# EAGLE design Stereo Schematic Design 1 (EAGLE 9.6.2)
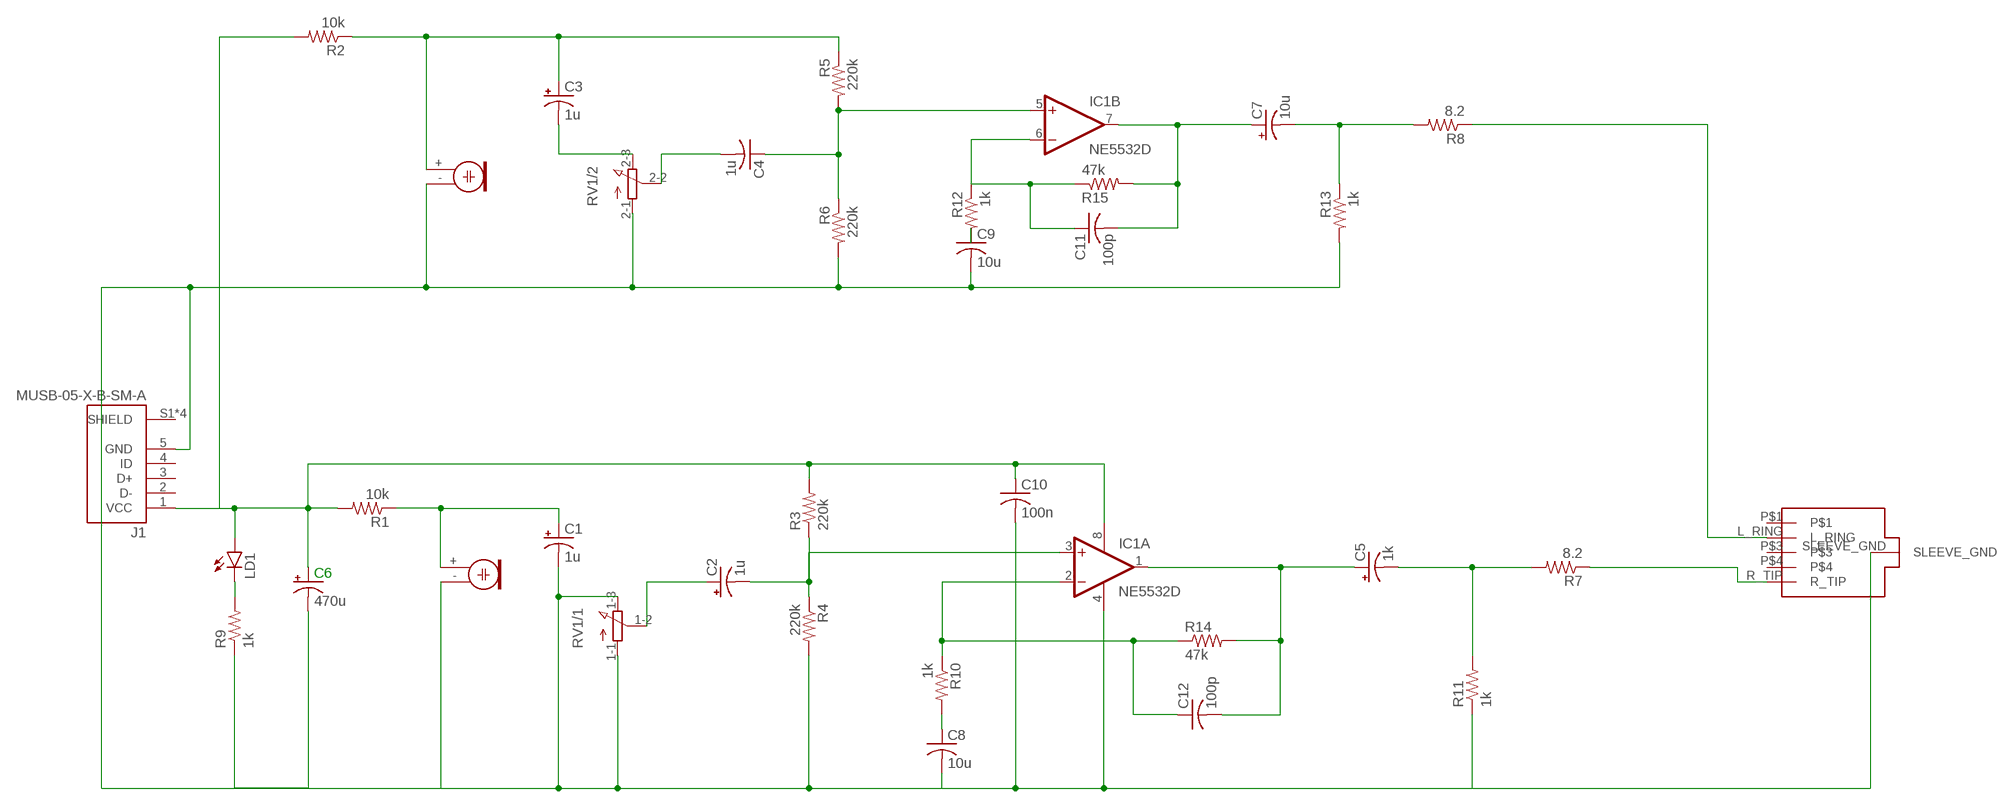
[diagram p0: schematic, sheet 1]

## Parts
C1  1u  CPOL-USE3.5-8  [E3,5-8]
C2  1u  CPOL-USE3.5-8  [E3,5-8]
C3  1u  CPOL-USE3.5-8  [E3,5-8]
C4  1u  C-USC0603  [C0603]
C5  1k  CPOL-USE3.5-8  [E3,5-8]
C6  470u  CPOL-USE3.5-8  [E3,5-8]
C7  10u  CPOL-USE3.5-8  [E3,5-8]
C8  10u  C-USC0805  [C0805]
C9  10u  C-USC0805  [C0805]
C10  100n  C-USC1206  [C1206]
C11  100p  C-USC0603  [C0603]
C12  100p  C-USC0603  [C0603]
IC1  NE5532D  [SO08]
J1  MUSB-05-X-B-SM-A  [SAMTEC_MUSB-05-X-B-SM-A]
LD1  LED3MM  [LED3MM]
M1  ELECTRET_MICROPHON-TOM-1545P-R  [TOM-1545P-R]
M2  ELECTRET_MICROPHON-TOM-1545P-R  [TOM-1545P-R]
R1  10k  R-US_R0805  [R0805]
R2  10k  R-US_R0805  [R0805]
R3  220k  R-US_R0603  [R0603]
R4  220k  R-US_R0603  [R0603]
R5  220k  R-US_R0603  [R0603]
R6  220k  R-US_R0603  [R0603]
R7  8.2  R-US_R0805  [R0805]
R8  8.2  R-US_R0805  [R0805]
R9  1k  R-US_R1206  [R1206]
R10  1k  R-US_R1206  [R1206]
R11  1k  R-US_R1206  [R1206]
R12  1k  R-US_R1206  [R1206]
R13  1k  R-US_0204/7  [0204/7]
R14  47k  R-US_0204/7  [0204/7]
R15  47k  R-US_0204/7  [0204/7]
RV1  3RP/1610G  [3RP/1610G]
U$1  KORTAKJACK  [REDPHONEJACK]

## Nets
N$1: C6.+ C10.1 IC1.8(P:V+) J1.1(VCC) LD1.A R1.2 R2.2 R3.2
N$2: LD1.K(C) R9.2
N$3: C1.- C8.2 C9.2 C10.2 IC1.4(P:V-) J1.5(GND) M2.- R4.2 R6.2 R11.1 R13.2 RV1.1-1(/1:A) RV1.1-3(/1:E) RV1.2-1(/2:A) U$1.SLEEVE_GND
N$4: C1.+ M1.+ R1.1
N$5: C8.1 R10.2
N$6: C2.+ RV1.1-2(/1:S)
N$7: C12.1 IC1.2(A:-IN) R10.1 R14.1
N$8: C5.+ C12.2 IC1.1(A:OUT) R14.2
N$9: C6.- R9.1
N$10: M1.-
N$11: C2.- IC1.3(A:+IN) R3.1 R4.1
N$12: C5.- R7.2 R11.2
N$13: R7.1 U$1.R_TIP
N$14: C3.+ M2.+ R2.1 R5.1
N$15: C3.- RV1.2-3(/2:E)
N$16: C4.2 RV1.2-2(/2:S)
N$17: C4.1 IC1.5(B:+IN) R5.2 R6.1
N$18: C11.1 IC1.6(B:-IN) R12.1 R15.1
N$19: C9.1 R12.2
N$20: C7.+ C11.2 IC1.7(B:OUT) R15.2
N$21: C7.- R8.2 R13.1
N$22: R8.1 U$1.L_RING
Unconnected: J1.2(D-) J1.3(D+) J1.4(ID) J1.S1(SHIELD) J1.S2(SHIELD) J1.S3(SHIELD) J1.S4(SHIELD) U$1.P$1 U$1.P$3 U$1.P$4

## Library data of the parts
C1-C3 C5-C7 = rcl:CPOL-US: POLARIZED CAPACITOR, American symbol; SPICEPREFIX: C
C4 C8-C12 = rcl:C-US: CAPACITOR, American symbol; SPICEPREFIX: C
IC1 = linear:NE5532: AUDIO AMPLIFIER
J1 = MUSB-05-X-B-SM-A:MUSB-05-X-B-SM-A: USB - mini B USB 2.0 Receptacle Connector 5 Position Surface Mount, Right Angle; MANUFACTURER: Samtec; MAXIMUM_PACKAGE_HEIGHT: 4.1 mm; PARTREV: AC; STANDARD: Manufacturer Recommendations
LD1 = led:LED: LED OSRAM: - CHIPLED LG R971, LG N971, LY N971, LG Q971, LY Q971, LO R971, LY R971 LH N974, LH R974 LS Q976, LO Q976, LY Q976 LO Q996 - Hyper CHIPLED LW Q18S LB Q993, LB Q99A, LB R99A - SideLED LS A670, LO A670, LY A670, LG A670, LP A670 LB A673, LV A673, LT A673, LW A673 LH A674 LY A675 LS A676, LA A676, LO A676, LY A676, LW A676 LS A679, LY A679, LG A679 - Hyper Micro SIDELED® LS Y876, LA Y876, LO Y876, LY Y876 LT Y87S - SmartLED LW L88C, LW L88S LB L89C, LB L89S, LG L890 LS L89K, LO L89K, LY L89K LS L896, LA L896, LO L896, LY L896 - TOPLED LS T670, LO T670, LY T670, LG T670, LP T670 LSG T670, LSP T670, LSY T670, LOP T670, LYG T670 LG T671, LOG T671, LSG T671 LB T673, LV T673, LT T673, LW T673 LH T674 LS T676, LA T676, LO T676, LY T676, LB T676, LH T676, LSB T676, LW T676 LB T67C, LV T67C, LT T67C, LS T67K, LO T67K, LY T67K, LW E67C LS E67B, LA E67B, LO E67B, LY E67B, LB E67C, LV E67C, LT E67C LW T67C LS T679, LY T679, LG T679 LS T770, LO T770, LY T770, LG T770, LP T770 LB T773, LV T773, LT T773, LW T773 LH T774 LS E675, LA E675, LY E675, LS T675 LS T776, LA T776, LO T776, LY T776, LB T776 LHGB T686 LT T68C, LB T68C - Hyper Mini TOPLED® LB M676 - Mini TOPLED Santana® LG M470 LS M47K, LO M47K, LY M47K Source: http://www.osram.convergy.de LUXEON: - LUMILED® LXK2-PW12-R00, LXK2-PW12-S00, LXK2-PW14-U00, LXK2-PW14-V00 LXK2-PM12-R00, LXK2-PM12-S00, LXK2-PM14-U00 LXK2-PE12-Q00, LXK2-PE12-R00, LXK2-PE12-S00, LXK2-PE14-T00, LXK2-PE14-U00 LXK2-PB12-K00, LXK2-PB12-L00, LXK2-PB12-M00, LXK2-PB14-N00, LXK2-PB14-P00, LXK2-PB14-Q00 LXK2-PR12-L00, LXK2-PR12-M00, LXK2-PR14-Q00, LXK2-PR14-R00 LXK2-PD12-Q00, LXK2-PD12-R00, LXK2-PD12-S00 LXK2-PH12-R00, LXK2-PH12-S00 LXK2-PL12-P00, LXK2-PL12-Q00, LXK2-PL12-R00 Source: www.luxeon.com KINGBRIGHT: KA-3528ASYC Source: www.kingbright.com
M1 M2 = microphon:ELECTRET_MICROPHON-: Electret Condenser Microphone
R1-R15 = rcl:R-US_: RESISTOR, American symbol; SPICEPREFIX: R
RV1 = pot:3RP/1610G: 16mm Potentiometer two level Source: http://www.alphapotentiometers.net/html/16mm_pot_2.html
U$1 = StereoAmp569:KORTAKJACK

## Board
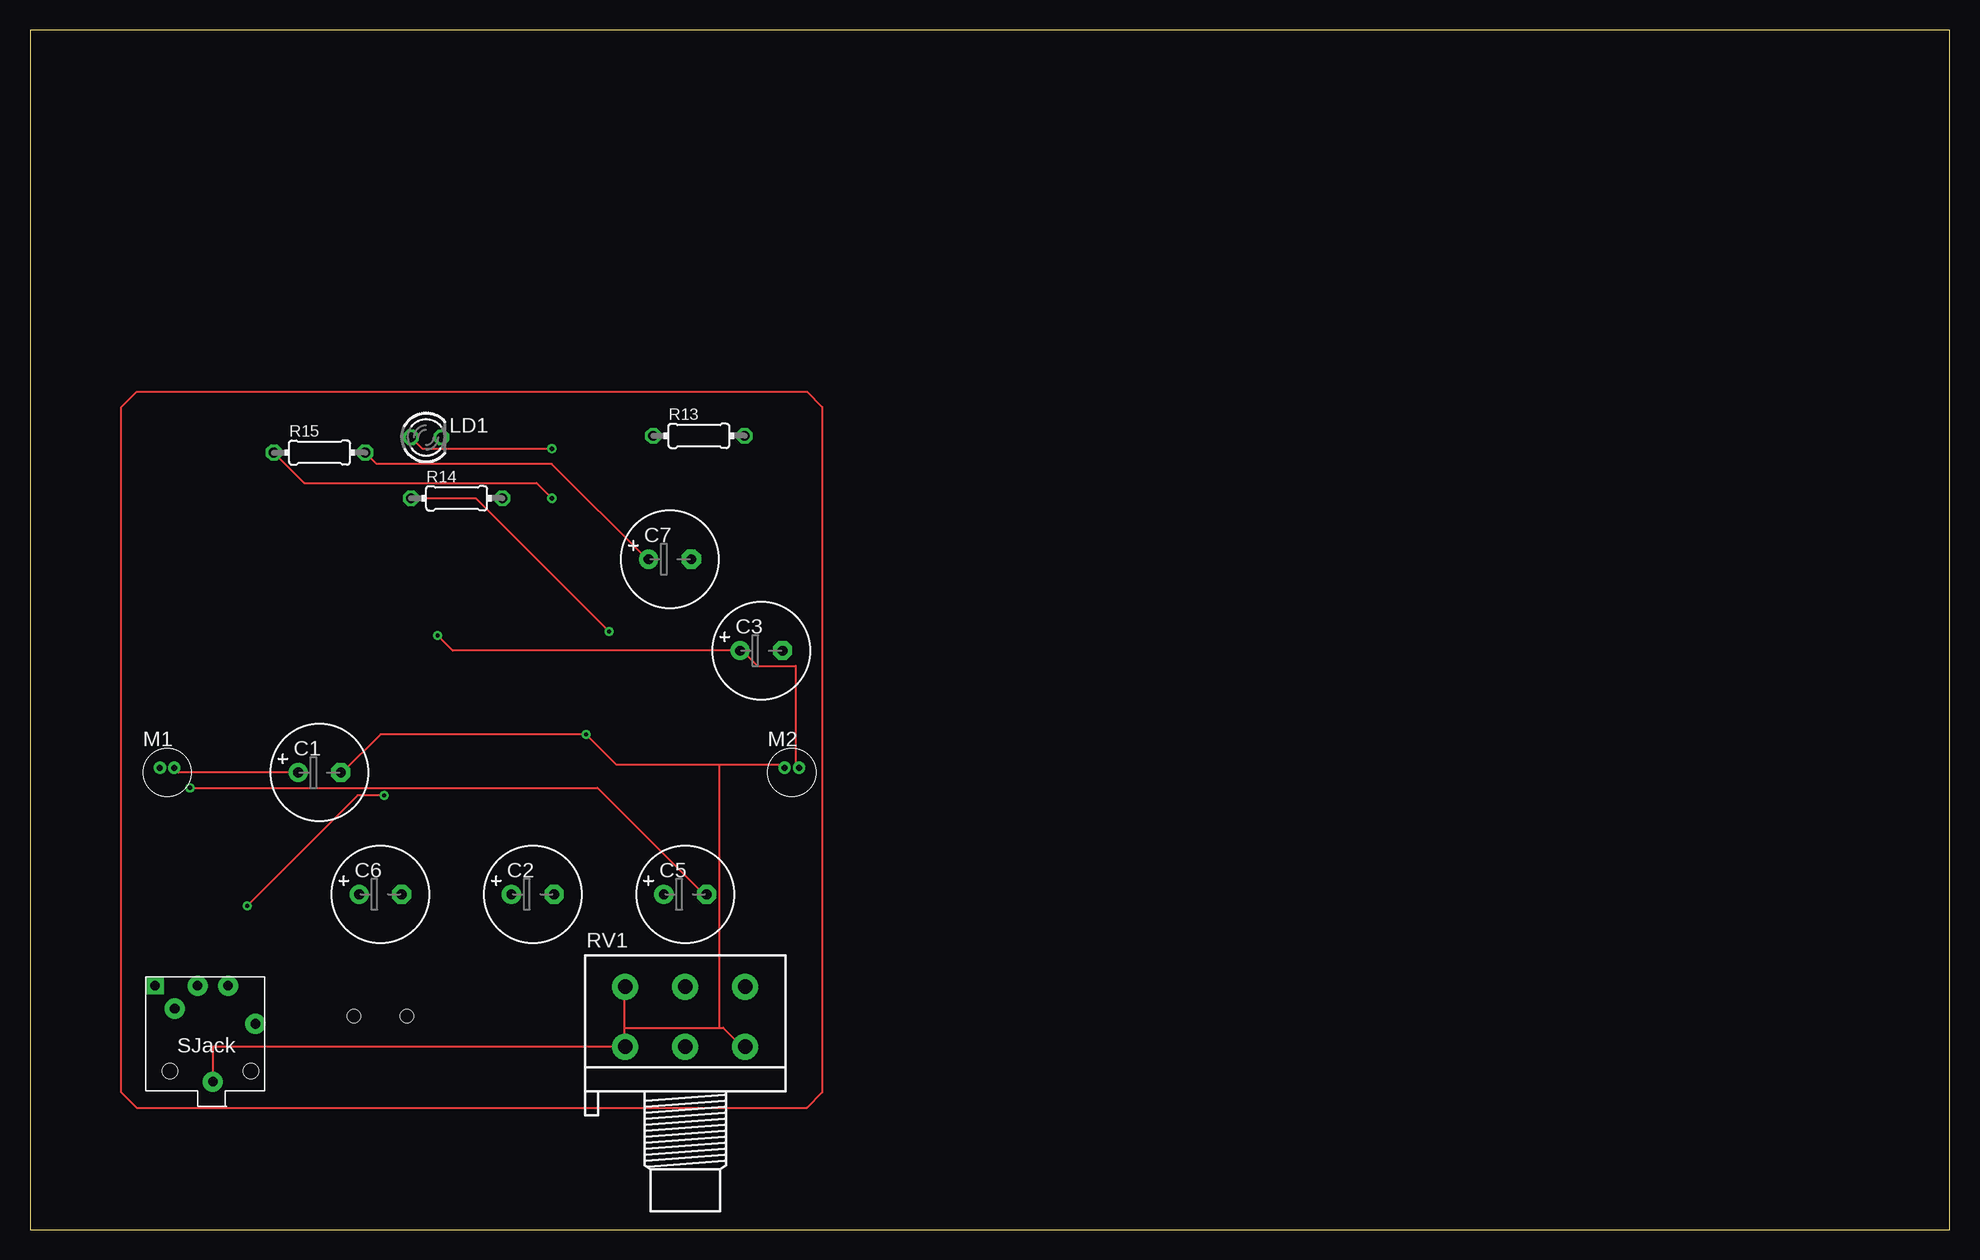
[diagram p1: board, top side]
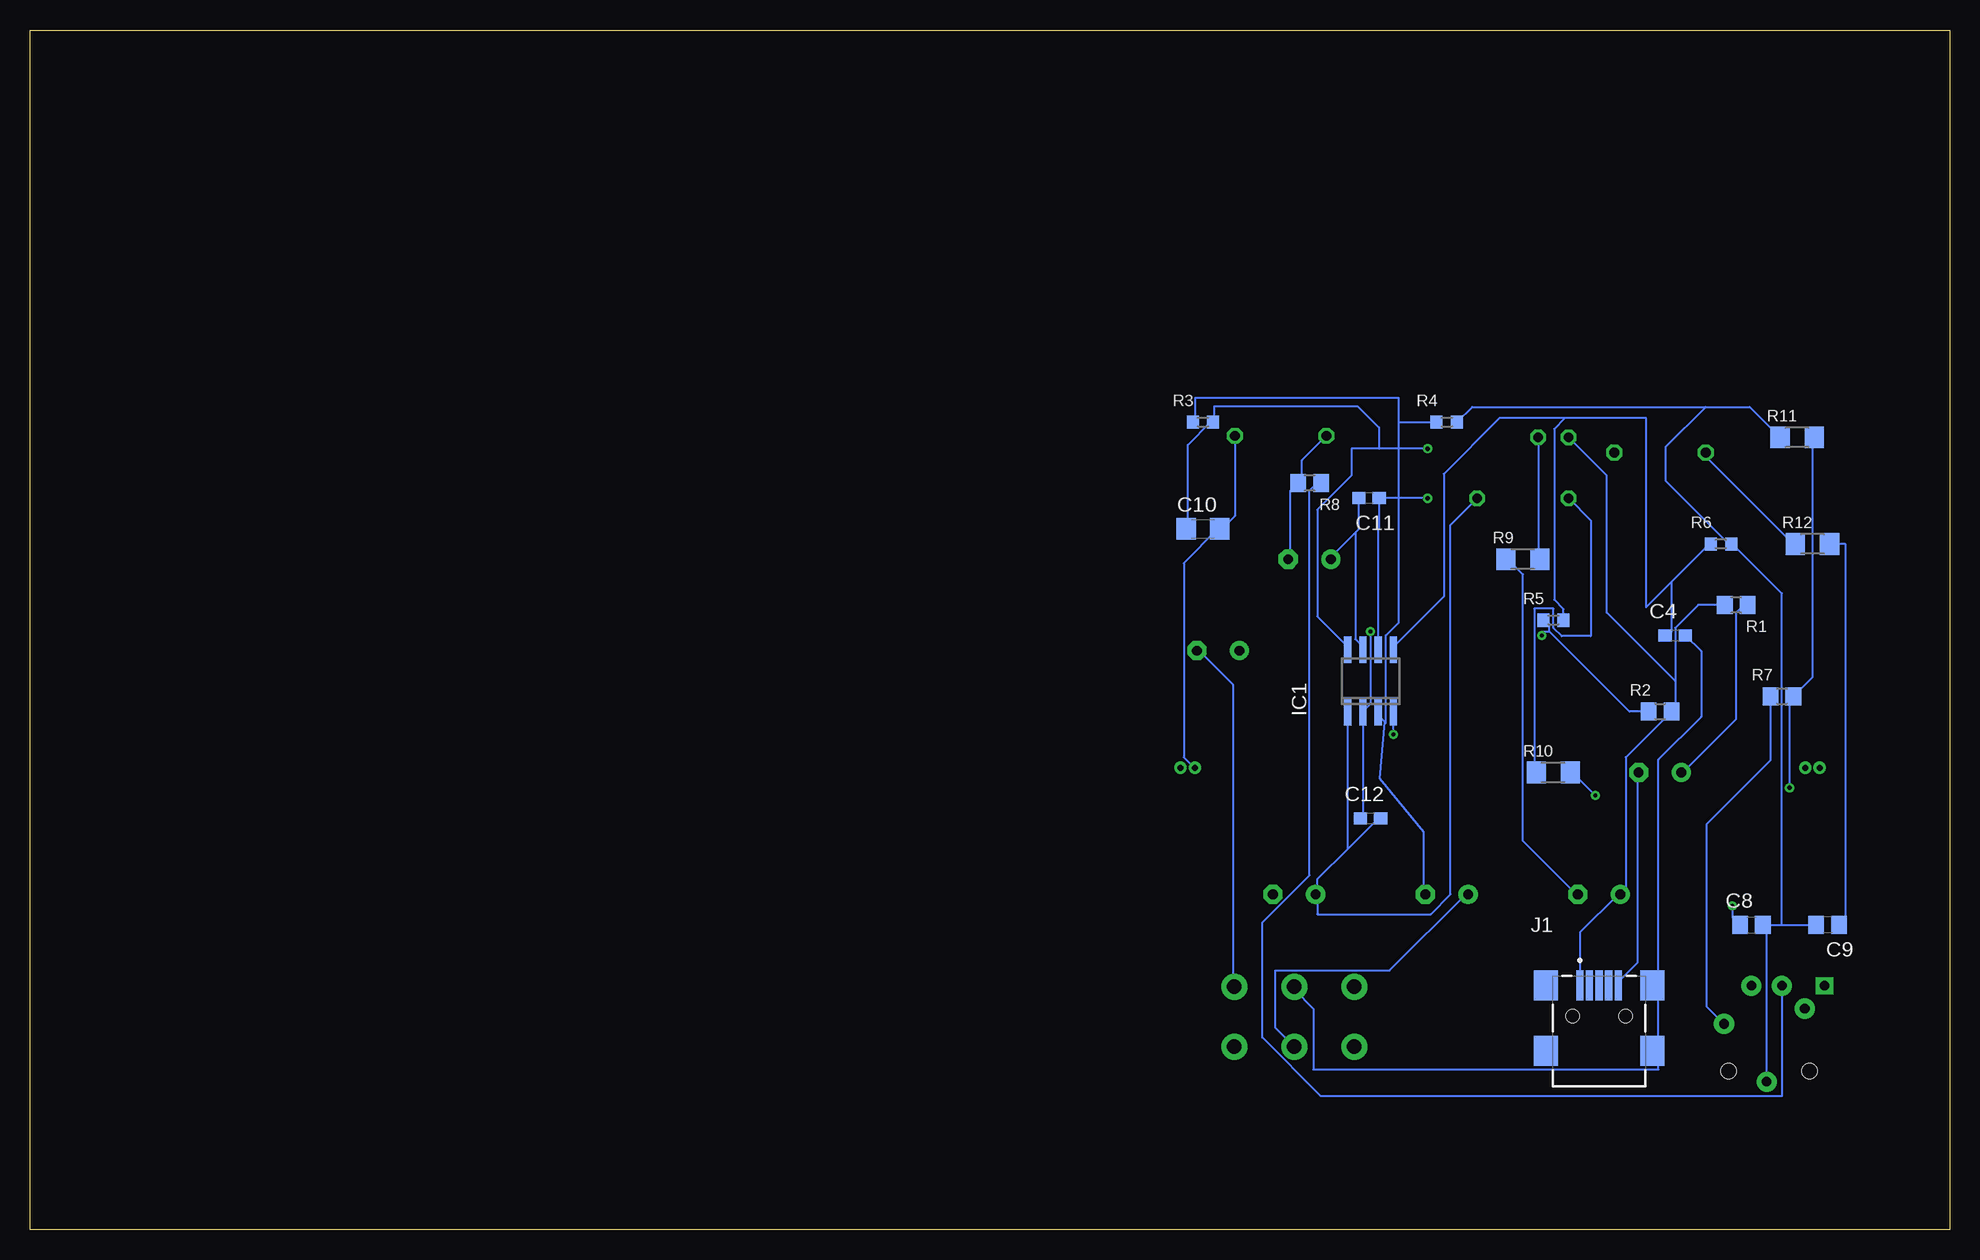
[diagram p2: board, bottom side, seen from below]

Size 160 x 100 mm. Coordinates in mm from the lower left corner, seen from the top.
Outline: 0,0 160,0 160,100 0,100 0,0
Copper layers (1*16): Top 0.035mm / dielectric 1.5mm / Bottom 0.035mm
Design rules "default": minimum track width 6mil, minimum drill 0.35mm, track to track 6mil, track to pad 6mil, pad to pad 6mil, via to via 6mil, smd to smd 6mil, copper to edge 40mil, drill to drill 6mil, minimum pad ring 10mil, minimum via ring 8mil, stop-mask expansion 4mil, vias tented up to drill 0mil, thermal gap 10mil

### Footprints (pad centres in the part's own frame; a part is rotated, then mirrored left to right if it is on the bottom)
E3,5-8 = drill 0.813 pad 1.6: + -1.778,0 | drill 0.813 pad 1.6 octagon: - 1.778,0
C0603 = smd 1.1 x 1: 1 -0.85,0; 2 0.85,0
C0805 = smd 1.3 x 1.5: 1 -0.95,0; 2 0.95,0
C1206 = smd 1.6 x 1.8: 1 -1.4,0; 2 1.4,0
SO08 = smd 0.6 x 2.2: 1 -1.905,-2.6; 2 -0.635,-2.6; 3 0.635,-2.6; 4 1.905,-2.6; 5 1.905,2.6; 6 0.635,2.6; 7 -0.635,2.6; 8 -1.905,2.6
SAMTEC_MUSB-05-X-B-SM-A = smd 0.6 x 2.5: 1 -1.6,2.58; 2 -0.8,2.58; 3 0,2.58; 4 0.8,2.58; 5 1.6,2.58 | smd 2 x 2.5: S1 -4.45,2.58; S2 4.45,2.58; S3 4.45,-2.87; S4 -4.45,-2.87 | hole 1.1: 2.2,0; -2.2,0
LED3MM = drill 0.813 octagon: A -1.27,0; K 1.27,0
TOM-1545P-R = drill 0.5 pad 0.8: + 0.6,0.4; - -0.6,0.4
R0805 = smd 1.3 x 1.5: 1 -0.95,0; 2 0.95,0
R0603 = smd 1 x 1.1: 1 -0.85,0; 2 0.85,0
R1206 = smd 1.6 x 1.803: 1 -1.422,0; 2 1.422,0
0204/7 = drill 0.813 octagon: 1 -3.81,0; 2 3.81,0
3RP/1610G = drill 1.2 pad 2.184: 1-1 -5,0; 1-2 0,0; 1-3 5,0; 2-1 -5,5; 2-2 0,5; 2-3 5,5
REDPHONEJACK = drill 0.8 pad 1.676: L_RING -3.81,0; P$3 -6.35,0; P$4 -1.905,1.905; R_TIP -8.636,3.175; SLEEVE_GND -5.08,8.001 | drill 0.8 pad 1.422 square: P$1 -0.254,0 | hole 1.27: -1.524,7.112; -8.255,7.112

### Placement (x,y rotation side)
C1  24.13,38.1 0 top
C2  41.91,27.94 0 top
C3  60.96,48.26 0 top
C4  22.86,49.53 0 bottom
C5  54.61,27.94 0 top
C6  29.21,27.94 0 top
C7  53.34,55.88 0 top
C8  16.51,25.4 0 bottom
C9  10.16,25.4 180 bottom
C10  62.23,58.42 0 bottom
C11  48.39,60.96 180 bottom
C12  48.26,34.29 0 bottom
IC1  48.26,45.72 0 bottom
J1  29.21,17.78 0 bottom
LD1  33.02,66.04 0 top
M1  11.43,38.1 0 top
M2  63.5,38.1 0 top
R1  17.78,52.07 180 bottom
R2  24.13,43.18 0 bottom
R3  62.23,67.31 0 bottom
R4  41.91,67.31 0 bottom
R5  33.02,50.8 0 bottom
R6  19.05,57.15 0 bottom
R7  13.97,44.45 0 bottom
R8  53.34,62.23 180 bottom
R9  35.56,55.88 0 bottom
R10  33.02,38.1 0 bottom
R11  12.7,66.04 0 bottom
R12  11.43,57.15 0 bottom
R13  55.75,66.17 0 top
R14  35.56,60.96 0 top
R15  24.13,64.77 0 top
RV1  54.61,15.24 0 top
U$1  10.16,20.32 180 top

### Tracks (layer width: path | path; a pad name or v marks a point on that pad's centre or on a via)
N$1  (via drill 0.35)
  Top 0.152: v43.5,65.09 32.7,65.09 LD1.A
  Bottom 0.152: C10.1 63.5,58.42 63.5,65.41 61.59,67.31 R3.2 61.28,67.31 61.28,68.64 49.34,68.64 47.56,66.86 47.56,65.09 | IC1.8 50.16,48.58 52.7,51.12 52.7,60.01 49.85,62.87 49.85,65.09 47.56,65.09 | J1.1 30.8,20.64 30.8,24.77 27.62,27.94 C6.+ 27.3,27.94 26.99,28.26 26.99,39.37 23.5,42.86 23.5,43.18 R2.2 22.86,43.5 22.86,45.72 | 22.86,45.72 22.86,50.16 20.95,52.07 R1.2 | LD1.A 28.57,62.87 28.57,51.44 22.86,45.72 | v43.5,65.09 47.56,65.09
N$2
  Bottom 0.152: LD1.K 34.29,55.88 R9.2
N$3  (via drill 0.35)
  Top 0.152: 57.47,38.73 62.87,38.73 M2.- | 57.47,38.73 48.9,38.73 v46.35,41.27 29.21,41.27 26.04,38.1 C1.- | 49.53,16.83 49.53,20 RV1.2-1 | 49.53,16.83 49.53,15.24 | 49.53,16.83 57.47,16.83 | 57.47,16.83 57.78,16.83 59.37,15.24 RV1.1-3 | U$1.SLEEVE_GND 15.24,15.24 49.53,15.24 | 49.53,15.24 RV1.1-1 | 57.47,16.83 57.47,38.73
  Bottom 0.152: J1.5 27.62,20.64 26.04,22.23 26.04,38.1 C1.- | R13.2 59.56,59.5 60.64,58.42 C10.2 60.96,58.42 63.82,55.56 63.82,39.37 63.18,38.73 M2.- | v46.35,41.27 IC1.4 | 20.32,68.58 23.69,65.22 23.69,62.42 18.41,57.15 R6.2 18.1,57.15 13.97,53.02 13.97,25.4 | R11.1 16.66,68.58 20.32,68.58 | R4.2 39.79,68.58 20.32,68.58 | 15.24,25.4 C8.2 | 15.24,25.4 13.97,25.4 | 13.97,25.4 C9.2 | U$1.SLEEVE_GND 15.24,25.4
N$4
  Top 0.152: C1.+ 12.38,38.1 12.06,38.42 M1.+
  Bottom 0.152: R1.1 17.14,52.07 17.78,51.44 17.78,42.55 22.23,38.1 C1.+
N$5  (via drill 0.35)
  Top 0.152: v18.1,26.99 27.3,36.2 v29.53,36.2
  Bottom 0.152: v18.1,26.99 18.1,26.04 C8.1 | v29.53,36.2 31.43,38.1 R10.2
N$6
  Bottom 0.152: RV1.1-2 56.2,16.83 56.2,21.59 46.67,21.59 40.32,27.94 C2.+
N$7  (via drill 0.35)
  Top 0.152: v48.26,49.85 37.15,60.96 R14.1
  Bottom 0.152: C12.1 48.9,34.29 IC1.2 48.9,43.18 48.26,43.81 v48.26,49.85 | R14.1 29.91,59.12 29.91,49.47 32.32,49.47 33.02,50.16 33.02,51.75 34.61,51.75 34.61,38.1 R10.1
N$8
  Bottom 0.152: 50.16,31.75 52.7,29.21 52.7,27.94 | 50.16,31.75 47.62,34.29 C12.2 | 50.16,31.75 IC1.1 | R14.2 41.59,58.74 41.59,27.94 43.24,26.29 52.7,26.29 52.7,27.94 | 52.7,27.94 C5.+
N$9
  Bottom 0.152: R9.1 36.83,55.88 35.56,54.61 35.56,32.38 31.11,27.94 C6.-
N$11
  Bottom 0.152: 45.91,67.31 R4.1 | R3.1 62.87,67.31 62.87,69.34 45.91,69.34 45.91,67.31 | 47.06,42.29 46.99,42.23 46.99,49.53 45.91,50.61 45.91,67.31 | 47.06,42.29 47.62,42.86 IC1.3 | 47.06,42.29 47.5,37.59 43.81,33.15 43.81,27.94 C2.-
N$12  (via drill 0.35)
  Top 0.152: v13.34,36.83 47.31,36.83 56.2,27.94 C5.-
  Bottom 0.152: R11.2 11.43,66.04 11.43,46.04 R7.2 13.34,44.45 v13.34,36.83
N$13
  Bottom 0.152: R7.1 14.92,39.12 20.26,33.78 20.26,18.61 U$1.R_TIP
N$14  (via drill 0.35)
  Top 0.152: M2.+ 63.82,38.73 63.82,46.99 60.64,46.99 59.37,48.26 C3.+ 35.24,48.26 v33.97,49.53
  Bottom 0.152: 33.34,49.85 33.34,50.48 33.66,50.8 R5.1 | 33.34,49.85 26.67,43.18 R2.1 | 33.34,49.85 33.97,49.85 v33.97,49.53
N$15
  Bottom 0.152: C3.- 62.55,48.26 59.69,45.4 59.69,20.32 RV1.2-3
N$16
  Bottom 0.152: C4.2 20.7,48.22 20.7,42.74 24.26,39.18 24.26,13.34 53.02,13.34 53.02,18.41 54.61,20 RV1.2-2
N$17
  Bottom 0.152: 23.18,53.98 23.18,49.85 23.5,49.53 C4.1 | 23.18,53.98 20,57.15 R6.1 | 23.18,53.98 25.27,51.88 25.27,67.63 32.07,67.63 | R5.2 32.17,51.73 32.96,52.51 32.96,66.74 32.07,67.63 | 32.07,67.63 37.53,67.63 42.16,62.99 42.16,52.77 46.35,48.58 IC1.5
N$18  (via drill 0.35)
  Top 0.152: v43.5,60.96 42.23,62.23 22.86,62.23 R15.1
  Bottom 0.152: IC1.6 47.62,58.42 47.54,58.51 C11.1 v43.5,60.96 | R15.1 20.32,64.45 13.02,57.15 R12.1
N$19
  Bottom 0.152: C9.1 8.7,25.91 8.7,57.15 R12.2
N$20
  Top 0.152: R15.2 28.89,63.82 43.5,63.82 51.44,55.88 C7.+
  Bottom 0.152: 49.53,58.1 51.44,56.2 51.44,55.88 C7.+ | 49.53,58.1 49.24,58.4 C11.2 | 49.53,58.1 49.53,49.21 48.9,48.58 IC1.7
N$21
  Bottom 0.152: C7.- 54.93,55.88 54.93,61.59 R8.2 53.98,62.23 53.98,64.14 R13.1
N$22
  Bottom 0.152: U$1.L_RING 13.97,11.11 52.39,11.11 57.28,16 57.28,25.59 53.34,29.53 53.34,61.59 52.7,62.23 R8.1
S$1
  Top 0.152: 7.62,11.43 8.89,10.16 64.77,10.16 66.04,11.43 66.04,68.58 64.77,69.85 8.89,69.85 7.62,68.58 7.62,11.43